# EAGLE board FE3_V3_R11d_corrected (EAGLE 7.7.0), part 1 of 2
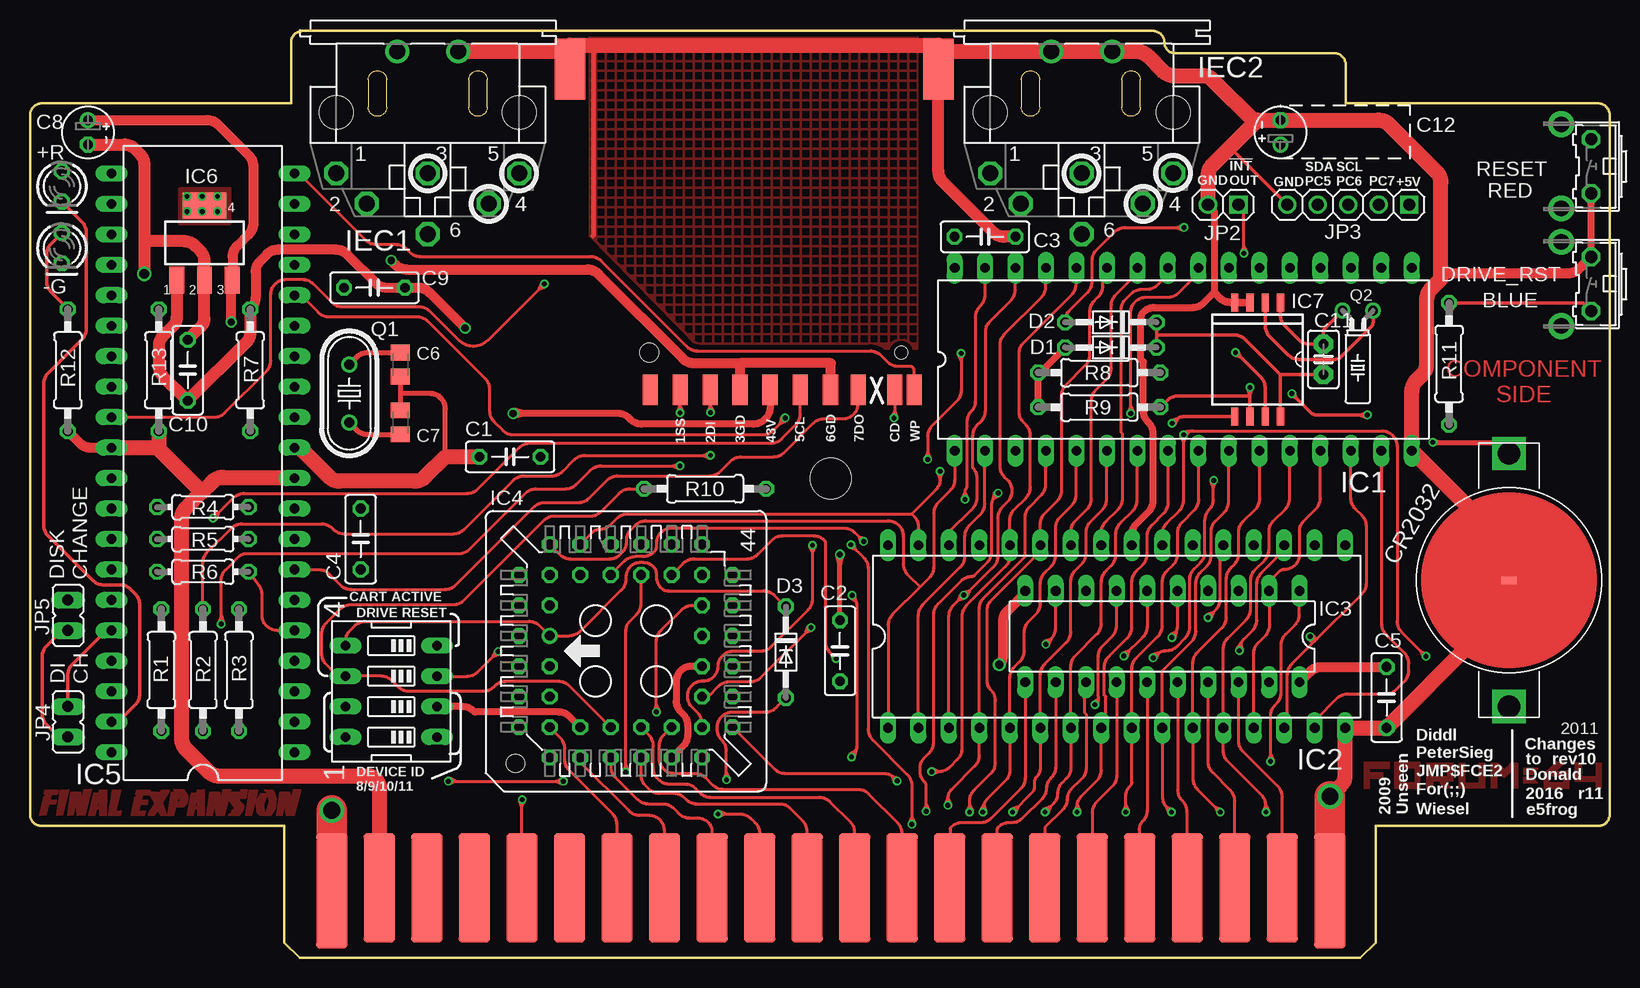
[diagram p1: board, top side]
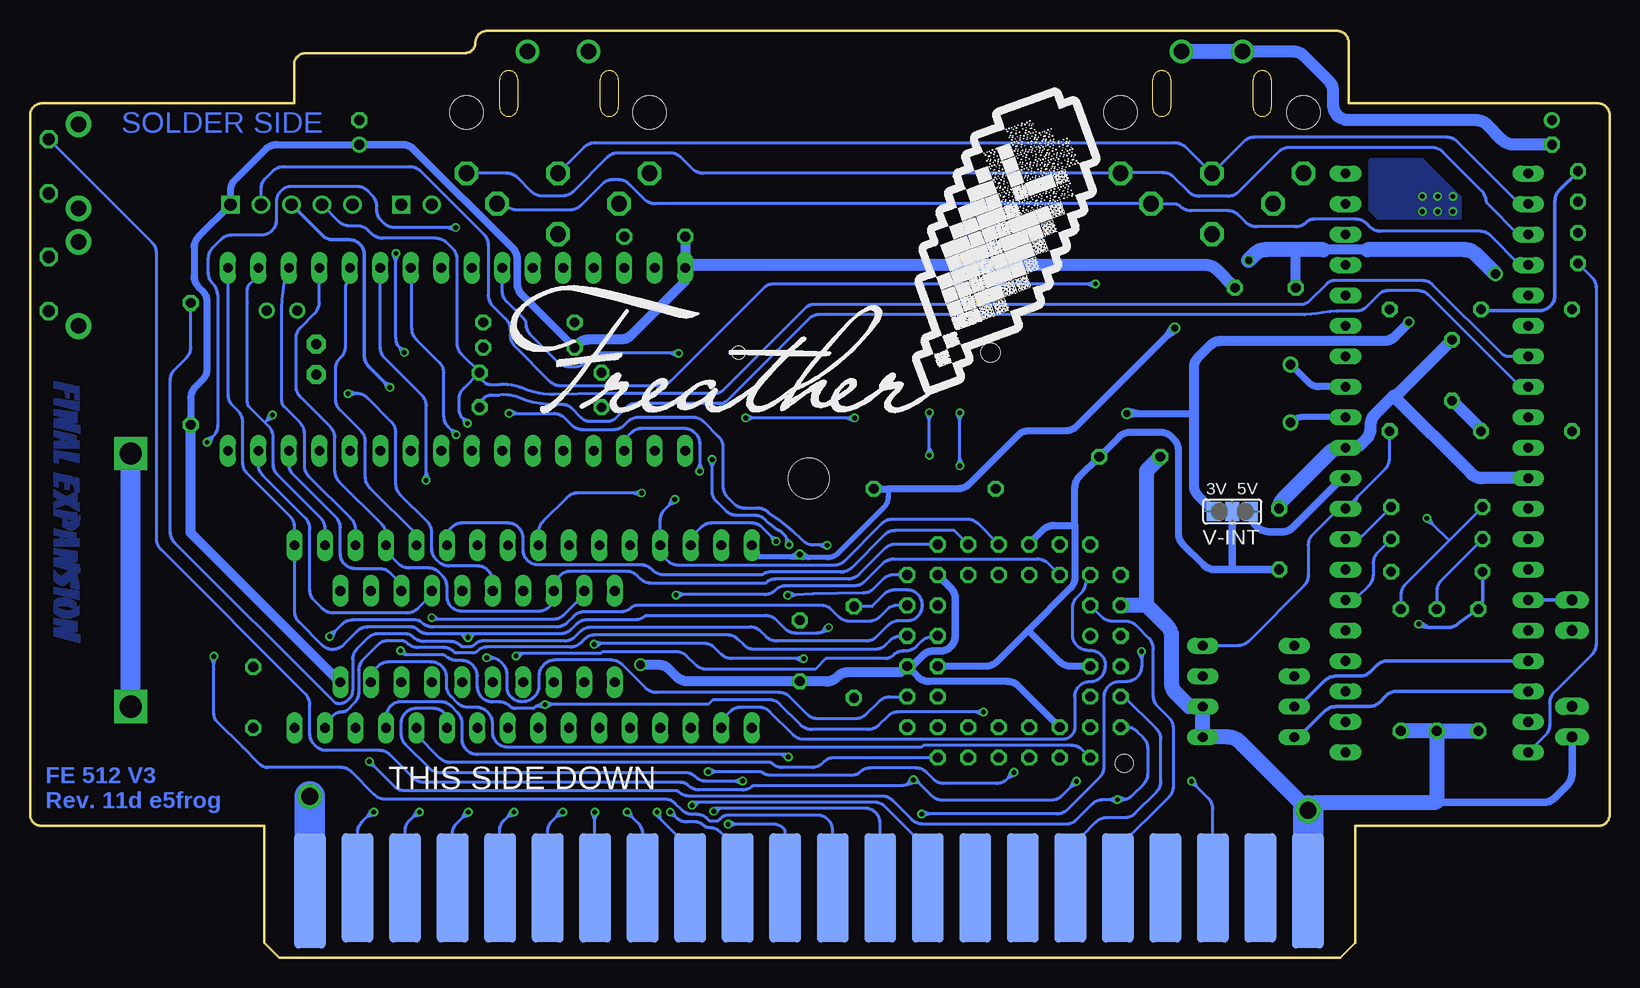
[diagram p2: board, bottom side, seen from below]

Size 131.65 x 77.3 mm. Coordinates in mm from the lower left corner, seen from the top.
Outline: 21.75,71.25 1,71.25 arc90 0,70.25 0,12 arc90 1,11 21.21,11 21.21,1.27 22.48,0 110.87,0 112.14,1.27 112.14,11 130.65,11 arc90 131.65,12 131.65,70.25 arc90 130.65,71.25 109.65,71.25 109.65,74.44 arc90 108.65,75.44 95.4,75.44 arc-90 94.54,76.3 arc90 93.54,77.3 22.75,77.3 arc90 21.75,76.3 21.75,71.25
Outline: 28.19,73.22 arc-180 29.72,73.22 29.72,70.93 arc-180 28.19,70.93 28.19,73.22
Outline: 36.57,73.22 arc-180 38.1,73.22 38.1,70.93 arc-180 36.57,70.93 36.57,73.22
Outline: 82.61,73.22 arc-180 84.14,73.22 84.14,70.93 arc-180 82.61,70.93 82.61,73.22
Outline: 90.99,73.22 arc-180 92.52,73.22 92.52,70.93 arc-180 90.99,70.93 90.99,73.22
Copper layers (1*16): Top 0.035mm / dielectric 1.5mm / Bottom 0.035mm
Design rules "ITEADstudio_DRC": minimum track width 6mil, minimum drill 12mil, track to track 6mil, track to pad 6mil, pad to pad 6mil, via to via 6mil, smd to smd 0mil, copper to edge 10mil, drill to drill 10mil, minimum pad ring 10mil, minimum via ring 6mil, stop-mask expansion 2mil, vias tented up to drill 100mil, thermal gap 10mil
Net classes: 1 DiffPair: width 0.254 mm, drill 0.4 mm, clearance 0.6 mm
Holes 3.4 mm at 66.74,39.97
Holes 1.5 mm at 40.45,16.22
Holes 1.6 mm at 51.6,50.47
Holes 1.1 mm at 72.6,50.47
tRestrict: area 116.9,15.2 to 118.1,15.8; area 126.6,14.7 to 127.7,15.1

## Footprints (pad centres in the part's own frame; a part is rotated, then mirrored left to right if it is on the bottom)
SMD1,27-2,54 = smd 1.27 x 2.54: 1 0,0
LED3MM = drill 0.813 octagon: A -1.27,0; K 1.27,0
C050-025X075 = drill 0.813 octagon: 1 -2.54,0; 2 2.54,0
C0805K = smd 1.3 x 1.6: 1 -1,0; 2 1,0
E2-4 = drill 0.813 pad 1.27: + -1.016,0 | drill 0.813 pad 1.27 octagon: - 1.016,0
C2.5-2 = drill 0.813 pad 1.6 octagon: 1 -1.27,0; 2 1.27,0
CR2032_RETAINER_PK5 = drill 1.85 square: P$1 -10.55,0; P$2 10.55,0 | smd 0.635 x 1.27: P$3 0,0
DO34-7 = drill 0.813 octagon: A 3.81,0; C -3.81,0
EDG-04 = drill 0.813 long: 1 -3.81,-3.81; 2 -1.27,-3.81; 3 1.27,-3.81; 4 3.81,-3.81; 5 3.81,3.81; 6 1.27,3.81; 7 -1.27,3.81; 8 -3.81,3.81
B3F-31XX = drill 1.016 octagon: 1 -2.261,-1.245; 2 2.261,-1.245 | drill 1.295 pad 2.159: 3 -3.505,1.245; 4 3.505,1.245
DIL32 = drill 0.813 long: 1 -17.78,-7.62; 2 -15.24,-7.62; 3 -12.7,-7.62; 4 -10.16,-7.62; 5 -7.62,-7.62; 6 -5.08,-7.62; 7 -2.54,-7.62; 8 0,-7.62; 9 2.54,-7.62; 10 5.08,-7.62; 11 7.62,-7.62; 12 10.16,-7.62; 13 12.7,-7.62; 14 15.24,-7.62; 15 17.78,-7.62; 16 20.32,-7.62; 17 20.32,7.62; 18 17.78,7.62; 19 15.24,7.62; 20 12.7,7.62; 21 10.16,7.62; 22 7.62,7.62; 23 5.08,7.62; 24 2.54,7.62; 25 0,7.62; 26 -2.54,7.62; 27 -5.08,7.62; 28 -7.62,7.62; 29 -10.16,7.62; 30 -12.7,7.62; 31 -15.24,7.62; 32 -17.78,7.62
DIL32' = drill 0.813 long: 1 -19.05,-7.62; 2 -16.51,-7.62; 3 -13.97,-7.62; 4 -11.43,-7.62; 5 -8.89,-7.62; 6 -6.35,-7.62; 7 -3.81,-7.62; 8 -1.27,-7.62; 9 1.27,-7.62; 10 3.81,-7.62; 11 6.35,-7.62; 12 8.89,-7.62; 13 11.43,-7.62; 14 13.97,-7.62; 15 16.51,-7.62; 16 19.05,-7.62; 17 19.05,7.62; 18 16.51,7.62; 19 13.97,7.62; 20 11.43,7.62; 21 8.89,7.62; 22 6.35,7.62; 23 3.81,7.62; 24 1.27,7.62; 25 -1.27,7.62; 26 -3.81,7.62; 27 -6.35,7.62; 28 -8.89,7.62; 29 -11.43,7.62; 30 -13.97,7.62; 31 -16.51,7.62; 32 -19.05,7.62
DIL20 = drill 0.813 long: 1 -11.43,-3.81; 2 -8.89,-3.81; 3 -6.35,-3.81; 4 -3.81,-3.81; 5 -1.27,-3.81; 6 1.27,-3.81; 7 3.81,-3.81; 8 6.35,-3.81; 9 8.89,-3.81; 10 11.43,-3.81; 11 11.43,3.81; 12 8.89,3.81; 13 6.35,3.81; 14 3.81,3.81; 15 1.27,3.81; 16 -1.27,3.81; 17 -3.81,3.81; 18 -6.35,3.81; 19 -8.89,3.81; 20 -11.43,3.81
S44 = drill 0.813: 1 1.27,6.35 | drill 0.813 octagon: 2 -1.27,8.89; 3 -1.27,6.35; 4 -3.81,8.89; 5 -3.81,6.35; 6 -6.35,8.89; 7 -8.89,6.35; 8 -6.35,6.35; 9 -8.89,3.81; 10 -6.35,3.81; 11 -8.89,1.27; 12 -6.35,1.27; 13 -8.89,-1.27; 14 -6.35,-1.27; 15 -8.89,-3.81; 16 -6.35,-3.81; 17 -8.89,-6.35; 18 -6.35,-8.89; 19 -6.35,-6.35; 20 -3.81,-8.89; 21 -3.81,-6.35; 22 -1.27,-8.89; 23 -1.27,-6.35; 24 1.27,-8.89; 25 1.27,-6.35; 26 3.81,-8.89; 27 3.81,-6.35; 28 6.35,-8.89; 29 8.89,-6.35; 30 6.35,-6.35; 31 8.89,-3.81; 32 6.35,-3.81; 33 8.89,-1.27; 34 6.35,-1.27; 35 8.89,1.27; 36 6.35,1.27; 37 8.89,3.81; 38 6.35,3.81; 39 8.89,6.35; 40 6.35,8.89; 41 6.35,6.35; 42 3.81,8.89; 43 3.81,6.35; 44 1.27,8.89
DIL40 = drill 0.813 long: 1 -24.13,-7.62; 2 -21.59,-7.62; 3 -19.05,-7.62; 4 -16.51,-7.62; 5 -13.97,-7.62; 6 -11.43,-7.62; 7 -8.89,-7.62; 8 -6.35,-7.62; 9 -3.81,-7.62; 10 -1.27,-7.62; 11 1.27,-7.62; 12 3.81,-7.62; 13 6.35,-7.62; 14 8.89,-7.62; 15 11.43,-7.62; 16 13.97,-7.62; 17 16.51,-7.62; 18 19.05,-7.62; 19 21.59,-7.62; 20 24.13,-7.62; 21 24.13,7.62; 22 21.59,7.62; 23 19.05,7.62; 24 16.51,7.62; 25 13.97,7.62; 26 11.43,7.62; 27 8.89,7.62; 28 6.35,7.62; 29 3.81,7.62; 30 1.27,7.62; 31 -1.27,7.62; 32 -3.81,7.62; 33 -6.35,7.62; 34 -8.89,7.62; 35 -11.43,7.62; 36 -13.97,7.62; 37 -16.51,7.62; 38 -19.05,7.62; 39 -21.59,7.62; 40 -24.13,7.62
SOT223 = smd 1.219 x 2.235: 1 -2.311,-3.099; 2 0,-3.099; 3 2.311,-3.099 | smd 3.6 x 2.2: 4 0,3.099
SOT176-1 = smd 0.6 x 1.5: 1 -1.905,-4.75; 2 -0.635,-4.75; 3 0.635,-4.75; 4 1.905,-4.75; 5 1.905,4.75; 6 0.635,4.75; 7 -0.635,4.75; 8 -1.905,4.75
MAB6H = drill 1.321 octagon: 1 7.62,5.08; 2 5.08,7.62; 3 0,5.08; 4 -5.08,7.62; 5 -7.62,5.08; 6 0,10.16 | drill 1.321: PE -2.54,-5.08; PE@ 2.54,-5.08 | hole 2.794: 7.62,0; -7.62,0
1X02 = drill 1.016 square: 1 -1.27,0 | drill 1.016: 2 1.27,0
1X05 = drill 1.016 square: 1 -5.08,0 | drill 1.016: 2 -2.54,0; 3 0,0; 4 2.54,0; 5 5.08,0
JP1 = drill 0.914 long: 1 0,-1.27; 2 0,1.27
SMD2,54-5,08 = smd 2.54 x 5.08: 1 0,0
HC49U-V = drill 0.813: 1 -2.413,0; 2 2.413,0
TC26H = drill 0.813: 1 -1.27,0; 2 1.27,0
0207/10 = drill 0.813 octagon: 1 -5.08,0; 2 5.08,0
0204/7 = drill 0.813 octagon: 1 -3.81,0; 2 3.81,0
VIC-20_EXPANSION = smd 2.6 x 9.6: P$1 -41.58,1.98; P$22 41.58,1.98 | smd 2.6 x 9.1: P$2 -37.62,2.23; P$3 -33.66,2.23; P$4 -29.7,2.23; P$5 -25.74,2.23; P$6 -21.78,2.23; P$7 -17.82,2.23; P$8 -13.86,2.23; P$9 -9.9,2.23; P$10 -5.94,2.23; P$11 -1.98,2.23; P$12 1.98,2.23; P$13 5.94,2.23; P$14 9.9,2.23; P$15 13.86,2.23; P$16 17.82,2.23; P$17 21.78,2.23; P$18 25.74,2.23; P$19 29.7,2.23; P$20 33.66,2.23; P$21 37.62,2.23 | smd 2.6 x 9.6 bottom: P$23 -41.58,1.98; P$44 41.58,1.98 | smd 2.6 x 9.1 bottom: P$24 -37.62,2.23; P$25 -33.66,2.23; P$26 -29.7,2.23; P$27 -25.74,2.23; P$28 -21.78,2.23; P$29 -17.82,2.23; P$30 -13.86,2.23; P$31 -9.9,2.23; P$32 -5.94,2.23; P$33 -1.98,2.23; P$34 1.98,2.23; P$35 5.94,2.23; P$36 9.9,2.23; P$37 13.86,2.23; P$38 17.82,2.23; P$39 21.78,2.23; P$40 25.74,2.23; P$41 29.7,2.23; P$42 33.66,2.23; P$43 37.62,2.23
SJ_2 = smd 1.168 x 1.6: 1 -1.524,0; 2 0,0; 3 1.524,0

## Placement (x,y rotation side)
1SS  [SMD1,27-2,54]  54.19,47.38 0 top
2DI  [SMD1,27-2,54]  56.7,47.38 0 top
3GD  [SMD1,27-2,54]  59.17,47.38 0 top
5CL  [SMD1,27-2,54]  64.2,47.38 0 top
6GD  [SMD1,27-2,54]  66.72,47.38 0 top
7DO  [SMD1,27-2,54]  69.01,47.38 0 top
43V  [SMD1,27-2,54]  61.68,47.38 0 top
+R  [LED3MM]  2.65,64.33 270 top
-G  [LED3MM]  2.65,59.18 270 top
C1  100nF  [C050-025X075]  40,41.78 180 top
C2  100nF  [C050-025X075]  67.5,25.61 270 top
C3  100nF  [C050-025X075]  79.59,60.13 0 top
C4  100nF  [C050-025X075]  27.56,34.92 90 top
C5  100nF  [C050-025X075]  113.05,21.72 270 top
C6  33pF  [C0805K]  30.86,49.48 270 top
C7  33pF  [C0805K]  30.86,44.65 90 top
C8  22µF  [E2-4]  4.82,68.83 270 top
C9  100nF  [C050-025X075]  28.7,55.88 180 top
C10  100nF  [C050-025X075]  13.15,49 90 top
C11  22pF  [C2.5-2]  107.79,49.91 90 top
C12  100µF  [E2-4]  104.2,68.83 90 top
CD  [SMD1,27-2,54]  72.06,47.38 0 top
CR2032  CR2032_RETAINER_PK5  [CR2032_RETAINER_PK5]  123.25,31.5 270 top
D1  BAT85  [DO34-7]  90.08,50.9 180 top
D2  BAT85  [DO34-7]  90.08,53 180 top
D3  BAT85  [DO34-7]  62.99,25.5 270 top
DEVICE  [EDG-04]  30.11,22.22 90 top
DRIVE_RST  [B3F-31XX]  128.85,56.2 90 top
IC1  AM29F040B  [DIL32]  94.83,49.91 0 top
IC2  4Mb-55  [DIL32']  90.55,26.8 0 top
IC3  74LS245N  [DIL20]  94.36,26.8 180 top
IC4  CPLD-ATF1504-AS  [S44]  49.66,25.59 90 top
IC5  ATMEGA1284P  [DIL40]  14.41,41.27 90 top
IC6  3V3REG_1703  [SOT223]  14.54,59.63 0 top
IC7  PCF8583T  [SOT176-1]  102.3,49.91 180 top
IEC1  MAB6H  [MAB6H]  33.15,70.5 180 top
IEC2  MAB6H  [MAB6H]  87.65,70.5 180 top
JP2  [1X02]  99.44,62.8 180 top
JP3  [1X05]  109.85,62.8 180 top
JP4  [JP1]  3.15,19.68 0 top
JP5  [JP1]  3.15,28.57 0 top
NC_9  [SMD1,27-2,54]  51.7,47.38 0 top
PAD1  [SMD2,54-5,08]  44.99,74.1 0 top
PAD2  [SMD2,54-5,08]  75.7,74.1 180 top
Q1  8.000MHz  [HC49U-V]  26.61,47.06 270 top
Q2  32768Hz  [TC26H]  110.65,53.98 180 top
R1  3k3  [0207/10]  10.95,24 90 top
R2  3k3  [0207/10]  14.41,24 90 top
R3  3k3  [0207/10]  17.41,24 90 top
R4  1k8  [0204/7]  14.41,37.59 0 top
R5  1k8  [0204/7]  14.41,34.92 0 top
R6  1k8  [0204/7]  14.41,32.2 0 top
R7  10k  [0207/10]  18.35,49 90 top
R8  1k8  [0207/10]  89.1,48.8 180 top
R9  1k8  [0207/10]  89.1,45.92 180 top
R10  10k  [0207/10]  56.26,39.12 180 top
R11  10k  [0207/10]  118.26,49.53 270 top
R12  470  [0207/10]  3.15,49 90 top
R13  470  [0207/10]  10.73,49 90 top
RESET  [B3F-31XX]  128.85,66 90 top
U$2  VIC-20_EXPANSION  [VIC-20_EXPANSION]  66.74,3.62 0 top
V-INT  [SJ_2]  31.46,37.22 0 bottom
WP  [SMD1,27-2,54]  73.68,47.36 0 top

## Tracks (layer width: path | path; a pad name or v marks a point on that pad's centre or on a via)
3V3  (via drill 0.6)
  Top 0.6: 43V.1 61.68,45.88 arc-45 61.3,44.99 61.2,44.88 arc-45 60.31,44.51 50.94,44.51 arc-45 50.05,44.88 49.9,45.03 arc45 49,45.4 v40.26,45.4 | v40.26,45.4 40.29,45.58 41.16,45.4 40.29,45.23 v40.26,45.4
  Top 0.813: C8.+ 14.78,69.85 arc-45 15.67,69.48 18.23,66.92 arc-45 18.6,66.02 18.6,61.23 arc-45 18.23,60.33 17.26,59.36 arc45 16.89,58.47 16.89,56.57 IC6.3 16.76,56.44 v16.76,53.02
  Bottom 0.6: v40.26,45.4 34.73,45.4 34.67,45.47 | v40.26,45.4 40.22,45.23 39.36,45.4 40.22,45.58 v40.26,45.4
  Bottom 0.813: v16.76,53.02 16.76,52.96 17.91,51.81 arc45 18.81,51.44 32.43,51.44 arc-45 33.33,51.06 34.3,50.09 arc-45 34.67,49.19 34.67,45.47 34.67,39.43 arc-45 34.3,38.54 V-INT.1
!C_RESET  (via drill 0.4)
  Top 0.254: v34.86,14.73 v44.45,14.73 | v58.04,14.86 58.04,17.25 arc45 57.67,18.15 57.65,18.17 arc-45 57.28,19.07 57.28,19.24 arc-90 58.55,20.51 61.29,20.51 arc45 62.19,20.88 D3.A | v58.04,14.86 57.82,14.96 58.04,15.46 58.26,14.96 v58.04,14.86 | v34.86,14.73 34.96,14.95 35.46,14.73 34.96,14.51 v34.86,14.73 | v44.45,14.73 44.35,14.51 43.85,14.73 44.35,14.95 v44.45,14.73
  Bottom 0.254: 33.15,5.65 33.08,5.59 U$2.P$25 33.08,12.42 arc-45 33.45,13.32 v34.86,14.73 | v44.45,14.73 45.66,13.52 arc45 46.56,13.14 55.61,13.14 arc45 56.5,13.52 57.85,14.86 v58.04,14.86 | v58.04,14.86 58.17,14.72 arc45 59.07,14.35 71.44,14.35 arc45 72.28,14 75.9,14 arc45 76.79,14.37 arc-45 77.43,14.64 98.82,14.64 arc45 99.72,15.01 101.64,16.93 arc-45 102.54,17.3 106.95,17.3 arc45 107.84,17.68 107.96,17.79 arc45 108.33,18.69 108.33,21.13 arc-45 108.7,22.02 120.72,34.05 arc45 121.09,34.94 121.09,58.73 arc-45 121.47,59.63 RESET.2 | v58.04,14.86 58.07,14.62 57.53,14.54 57.84,14.99 v58.04,14.86 | v58.04,14.86 58.25,14.97 58.51,14.48 57.98,14.62 v58.04,14.86 | v34.86,14.73 34.95,14.51 34.44,14.31 34.63,14.82 v34.86,14.73 | v44.45,14.73 44.68,14.82 44.87,14.31 44.36,14.51 v44.45,14.73
!RESET
  Top 0.254: DEVICE.5 26.3,26.41 arc-45 26.67,27.3 27.06,27.7 arc-45 27.96,28.07 41.57,28.07 arc-45 42.47,27.7 42.93,27.23 arc45 43.83,26.86 | D3.C 62.96,29.3 62.03,30.23 arc45 61.13,30.61 53.2,30.61 arc-45 52.57,30.87 arc-45 52.2,31.77 52.2,32.1 arc45 52,32.59 arc45 51.1,32.96 50.82,32.96 arc45 50.03,32.63 arc45 49.66,31.73 49.66,31.58 arc-45 49.28,30.68 45.84,27.23 arc-45 44.94,26.86 43.83,26.86 | IC4.1 43.83,26.86
  Top 0.305: R11.1 129.42,54.61 DRIVE_RST.1
  Bottom 0.254: D3.C 61.5,29.3 60.5,30.3 arc45 59.61,30.67 58.55,30.67 arc90 57.28,29.4 arc90 58.55,28.13 59.23,28.13 arc-45 60.12,27.76 61.09,26.79 arc45 61.99,26.42 69.42,26.42 arc45 70.32,26.79 70.75,27.22 arc-45 71.65,27.59 84.91,27.59 arc-45 85.81,27.22 86.21,26.82 arc45 87.11,26.45 93.77,26.45 arc-45 94.67,26.08 arc45 95,25.94 95.56,25.94 arc45 95.73,26.01 arc-45 96.63,26.38 98.82,26.38 arc45 99.72,26.76 arc-45 100.35,27.02 102.63,27.02 arc-45 103.53,26.65 104.4,25.77 arc-45 104.77,24.87 104.77,22.29 arc45 105.07,21.58 arc45 105.97,21.21 arc45 106.32,21.35 119.58,34.62 arc45 119.95,35.52 119.95,48.18 arc45 119.58,49.08 118.61,50.05 arc-45 118.24,50.95 118.24,54.59 R11.1
!WE  (via drill 0.4)
  Top 0.254: IC1.31 79.59,55.29 arc-45 79.22,54.39 79.14,54.31 arc45 78.77,53.42 78.77,46.37 arc-45 78.44,45.58 arc45 78.07,44.69 78.07,39.37 arc-45 77.91,38.99 v77.91,38.23 | v77.91,38.23 77.69,38.33 77.91,38.83 78.14,38.33 v77.91,38.23
  Bottom 0.254: v77.91,38.23 78.75,37.39 arc-45 79.12,36.49 IC2.29 79.12,33.72 78.51,33.11 arc-45 77.61,32.73 64.66,32.73 arc-45 63.76,33.11 60.66,36.2 arc45 59.77,36.58 53.55,36.58 arc45 52.65,36.2 IC4.33 | v77.91,38.23 78.14,38.31 78.34,37.8 77.83,38 v77.91,38.23
+5V  (via drill 0.5, 0.6)
  Top 0.406: C2.1 v67.5,33.64 | v67.5,33.64 67.71,33.58 67.5,32.89 67.29,33.58 v67.5,33.64
  Top 0.6: R9.2 R8.2 84.17,48.8 D1.A
  Top 0.813: IC3.20 106.69,23.89 arc-45 107.59,24.26 C5.1 | R7.2 18.42,54.15 arc45 18.79,55.05 18.79,57.2 arc-45 19.17,58.09 19.76,58.68 arc-45 20.65,59.05 25.51,59.05 arc-45 26.41,58.68 28.84,56.25 arc45 29.73,55.88 C9.1 32.37,55.88 arc-45 33.26,55.51 v36.26,52.51 | R12.1 4.15,42.92 arc45 5.05,42.55 IC5.30
  Top 1: 21.97,40.07 IC5.10
  Top 1.016: IC6.1 12.23,53.4 arc-45 11.94,52.7 11.03,51.79 arc45 10.74,51.09 10.74,49.28 arc45 11.03,48.58 C10.1 18.06,51.37 arc45 18.35,52.08 R7.2
  Top 1.27: 14.32,38.83 13.01,37.52 arc45 12.64,36.62 12.64,18.31 arc45 13.01,17.41 14.87,15.55 arc45 15.77,15.18 28.12,15.18 arc-90 29.12,14.18 U$2.P$2 | 14.32,38.83 15.19,39.7 arc-45 16.08,40.07 21.97,40.07 | IC5.30 10.6,42.55 10.73,42.42 | 10.73,42.42 14.32,38.83 | R13.1 10.73,42.42
  Top 1.422: 29.14,5.63 U$2.P$2
  Bottom 0.406: 60.13,39.12 60.13,38.44 arc45 60.5,37.54 64.29,33.75 arc45 65.19,33.38 67.24,33.38 v67.5,33.64 | IC2.32 71.47,34.39 71.47,33.83 71.09,33.45 67.69,33.45 v67.5,33.64 | v67.5,33.64 67.51,33.42 66.8,33.38 67.37,33.81 v67.5,33.64 | v67.5,33.64 67.61,33.82 68.23,33.45 67.51,33.42 v67.5,33.64
  Bottom 0.6: IC5.10 22.54,40.01 | R11.2 118.26,46.7 arc45 117.88,47.6 117.27,48.21 arc-45 116.9,49.1 116.9,54.72 arc-45 117.27,55.62 117.61,55.95 arc45 117.98,56.85 117.98,59.23 arc45 117.61,60.12 JP3.1 114.93,63.99 arc45 114.56,64.89 112,67.45 arc45 111.11,67.82 C12.+ | R10.1 60.13,39.12 54.31,39.12 arc-45 53.41,39.49 49.33,43.57 arc45 48.43,43.94 45.36,43.94 arc-45 44.46,44.31 v36.26,52.51 | v36.26,52.51 36.41,52.61 36.89,51.88 36.16,52.36 v36.26,52.51
  Bottom 0.61: 86.26,50.9 D1.A 90.69,55.32 arc45 91.06,56.22 91.06,58.27 arc-45 91.43,59.17 99.7,67.45 arc-45 100.6,67.82 C12.+ | IC1.32 77.05,57.88 | 22.54,40.01 arc45 22.7,39.61 26.42,35.89 arc45 27.32,35.52 28.29,35.52 arc92 V-INT.3
  Bottom 0.813: IC3.20 118.26,35.45 R11.2 | C3.1 IC1.32 | IC1.32 | IC1.32 77.05,56.43 81.54,51.93 arc45 82.44,51.56 85.08,51.56 arc-45 85.98,51.19 D1.A
  Bottom 1.016: C9.1 32.77,57.41 arc-45 33.67,57.78 77.05,57.78 IC1.32 | R13.1 arc-45 10.82,44.13 C10.1
A0  (via drill 0.4)
  Top 0.254: IC1.12 104.96,42.27 104.96,38.31 arc-45 104.59,37.41 103.62,36.44 arc45 103.25,35.54 103.25,34.05 arc-45 102.88,33.16 102.1,32.38 arc45 101.73,31.48 101.73,29.1 arc-45 101.35,28.2 99.81,26.66 arc45 99.44,25.76 IC2.12 99.44,17.29 arc45 99.81,16.39 102.62,13.58 arc-45 103,12.68 v103,12.16 | v103,12.16 102.77,12.26 102.99,12.76 103.22,12.26 v103,12.16
  Bottom 0.254: U$2.P$43 104.36,10.43 arc45 103.99,11.33 103.16,12.16 v103,12.16 | IC2.12 99.44,18.61 97.49,16.66 arc-45 96.6,16.29 69.94,16.29 arc45 69.84,16.25 arc-45 68.94,15.87 66.5,15.87 arc-45 65.6,16.25 65.52,16.33 arc45 64.62,16.7 IC4.17 | v103,12.16 103.2,12.29 103.49,11.82 102.95,11.92 v103,12.16
A1  (via drill 0.4)
  Top 0.254: IC1.11 102.49,42.27 102.49,38.31 arc-45 102.12,37.41 101.08,36.38 arc45 100.71,35.48 100.71,33.67 arc-45 100.34,32.77 100.07,32.5 arc45 99.69,31.61 99.69,28.4 arc-45 99.32,27.5 97.27,25.45 arc45 96.9,24.56 IC2.11 96.9,14.97 arc45 97.27,14.07 v99.19,12.16 | v72.26,14.76 72.03,14.99 arc45 71.13,15.37 62.95,15.37 arc-45 62.05,15.74 IC4.18 | v99.19,12.16 98.96,12.07 98.76,12.59 99.27,12.39 v99.19,12.16 | v72.26,14.76 72.04,14.66 71.82,15.17 72.34,14.99 v72.26,14.76
  Bottom 0.254: U$2.P$42 100.39,5.6 100.39,10.59 arc45 100.02,11.48 99.34,12.16 v99.19,12.16 | v72.26,14.76 75.32,14.76 arc45 76.22,15.14 arc-45 77.01,15.46 97.48,15.46 arc45 98.38,15.83 100.37,17.82 arc45 100.74,18.72 100.74,19.53 arc90 99.47,20.8 98.03,20.8 arc45 97.13,20.42 96.9,20.19 IC2.11 | v99.19,12.16 99.39,12.29 99.68,11.82 99.14,11.92 v99.19,12.16 | v72.26,14.76 72.36,14.99 72.86,14.76 72.36,14.54 v72.26,14.76
A2  (via drill 0.4)
  Top 0.254: IC1.10 99.88,42.27 99.88,38.05 arc-45 99.51,37.16 98.8,36.44 arc45 98.42,35.54 98.42,33.55 arc-45 98.05,32.65 97.53,32.12 arc45 97.15,31.22 97.15,27.26 arc-45 96.78,26.36 94.36,23.94 IC2.10 94.36,13.45 arc45 94.73,12.55 v95.12,12.16 | v95.12,12.16 94.9,12.07 94.7,12.59 95.21,12.39 v95.12,12.16
  Bottom 0.254: U$2.P$41 96.46,5.62 96.46,10.33 arc45 96.08,11.23 95.15,12.16 v95.12,12.16 | v95.12,12.16 95.34,12.26 95.56,11.75 95.04,11.93 v95.12,12.16
A3  (via drill 0.4)
  Top 0.254: IC1.9 97.41,42.27 97.41,38.24 arc-45 97.04,37.35 96,36.31 arc45 95.63,35.41 95.63,33.67 arc-45 95.26,32.77 94.73,32.25 arc45 94.36,31.35 94.36,27.7 arc-45 93.99,26.81 92.19,25.01 arc45 91.82,24.11 IC2.9 91.82,14.67 arc-45 91.68,14.34 arc45 91.31,13.44 v91.31,12.16 | v91.31,12.16 91.09,12.26 91.31,12.76 91.53,12.26 v91.31,12.16
  Bottom 0.254: U$2.P$40 92.52,5.64 92.52,10.59 arc45 92.15,11.48 91.47,12.16 v91.31,12.16 | v91.31,12.16 91.52,12.29 91.81,11.82 91.27,11.92 v91.31,12.16
A4  (via drill 0.4)
  Top 0.254: IC1.8 94.87,42.27 94.87,37.99 arc-45 94.5,37.09 93.46,36.06 arc45 93.09,35.16 93.09,33.67 arc-45 92.72,32.77 92.19,32.25 arc45 91.82,31.35 91.82,27.58 arc-45 91.45,26.68 89.91,25.14 arc45 89.53,24.24 89.53,21.91 89.66,21.78 89.66,20.45 89.28,20.07 IC2.8 89.28,15.67 arc-45 88.91,14.77 87.62,13.48 arc45 87.25,12.59 v87.25,12.16 | v87.25,12.16 87.03,12.26 87.26,12.76 87.47,12.25 v87.25,12.16
  Bottom 0.254: U$2.P$39 88.52,5.6 88.52,10.52 arc45 88.15,11.42 87.41,12.16 v87.25,12.16 | v87.25,12.16 87.45,12.29 87.74,11.82 87.2,11.92 v87.25,12.16
A5  (via drill 0.4)
  Top 0.254: IC1.7 92.27,42.27 92.27,38.18 arc-45 91.89,37.28 90.86,36.25 arc45 90.49,35.35 90.49,33.61 arc-45 90.12,32.71 89.65,32.25 arc45 89.28,31.35 89.28,27.89 arc-45 88.91,27 87.11,25.2 arc45 86.74,24.3 IC2.7 86.74,15.86 arc-45 86.37,14.96 85.98,14.57 arc45 85.63,13.73 arc-45 85.26,12.84 v84.58,12.16 | v84.58,12.16 84.49,12.39 85.01,12.59 84.81,12.07 v84.58,12.16
  Bottom 0.254: U$2.P$38 84.58,5.62 v84.58,12.16 | v84.58,12.16 84.8,12.06 84.58,11.56 84.36,12.06 v84.58,12.16
A6  (via drill 0.4)
  Top 0.254: IC1.6 89.73,42.27 89.73,38.24 arc-45 89.35,37.35 88.38,36.38 arc45 88.01,35.48 88.01,33.74 arc-45 87.64,32.84 87.11,32.31 arc45 86.74,31.41 86.74,27.2 arc-45 86.37,26.3 84.57,24.5 arc45 84.2,23.6 IC2.6 84.2,15.88 arc-45 83.88,15.11 arc45 83.69,14.65 83.69,14.54 83.69,14.23 arc-45 83.51,13.79 v81.88,12.16 | v81.88,12.16 81.8,12.39 82.31,12.59 82.11,12.07 v81.88,12.16
  Bottom 0.254: U$2.P$37 80.58,5.62 80.58,10.33 arc-45 80.95,11.23 v81.88,12.16 | v81.88,12.16 81.97,11.93 81.46,11.74 81.66,12.25 v81.88,12.16
A7  (via drill 0.4)
  Top 0.254: 87.18,42.27 IC1.5 87.18,42.26 87.18,38.63 arc-45 86.81,37.73 85.84,36.76 arc45 85.47,35.86 85.47,33.55 arc-45 85.1,32.65 84.57,32.12 arc45 84.2,31.22 84.2,29.55 arc-45 83.83,28.65 83.24,28.06 arc45 82.87,27.16 82.87,25.61 arc-45 82.5,24.71 82.03,24.25 arc45 81.66,23.35 IC2.5 81.66,15.67 arc-45 81.29,14.77 79.78,13.26 arc45 79.41,12.36 v79.41,12.16 | v79.41,12.16 79.2,12.28 79.47,12.76 79.64,12.23 v79.41,12.16
  Bottom 0.254: 76.64,5.61 U$2.P$36 76.87,5.83 76.87,9.37 79.15,11.65 arc37 v79.41,12.16 | v79.41,12.16 79.56,11.97 79.13,11.63 79.16,12.18 v79.41,12.16
A8  (via drill 0.4)
  Top 0.254: v78.29,12.16 78.29,13.06 arc-45 78.67,13.96 80.08,15.38 arc45 80.45,16.27 80.45,21.45 arc45 80.08,22.34 arc-45 79.76,23.13 79.76,28.94 arc-45 80.13,29.84 84.07,33.78 84.07,34.29 IC2.27 84.2,36.18 arc-45 84.57,37.08 85.61,38.11 arc45 85.98,39.01 85.98,46.91 arc-45 86.35,47.81 87.96,49.41 arc45 88.33,50.31 88.33,53.89 arc-45 88.7,54.79 89.04,55.13 arc45 89.41,56.02 89.41,56.77 89.75,57.12 IC1.27 | v78.29,12.16 78.07,12.26 78.29,12.76 78.52,12.26 v78.29,12.16
  Bottom 0.254: U$2.P$35 72.68,9.05 74.11,10.48 arc-45 75.01,10.85 arc45 75.57,11.09 arc-45 76.17,11.34 76.91,11.34 arc45 77.81,11.71 78.26,12.16 v78.29,12.16 | v78.29,12.16 78.37,11.93 77.86,11.75 78.07,12.26 v78.29,12.16
A9  (via drill 0.4)
  Top 0.254: IC2.26 86.74,35.54 arc-45 87.11,36.44 88.08,37.41 arc45 88.46,38.31 88.46,46.46 arc-45 88.83,47.36 89.73,48.27 arc45 90.11,49.17 90.11,54.4 arc-45 90.48,55.3 92.27,57.09 92.27,57.52 IC1.26 | v77.6,50.42 77.6,47.33 arc-45 77.22,46.43 75.17,44.38 arc45 74.8,43.48 v74.8,41.56 | v68.4,34.45 69.48,33.38 arc-45 69.85,32.48 69.85,19.07 arc45 70.22,18.17 73.12,15.27 arc-45 73.49,14.37 v73.49,11.15 | v73.49,11.15 73.27,11.25 73.49,11.75 73.71,11.25 v73.49,11.15 | v68.4,34.45 68.63,34.54 68.83,34.03 68.32,34.23 v68.4,34.45 | v77.6,50.42 77.82,50.32 77.6,49.82 77.37,50.32 v77.6,50.42 | v74.8,41.56 74.58,41.66 74.8,42.16 75.02,41.66 v74.8,41.56
  Bottom 0.254: U$2.P$34 68.72,10.54 arc-45 68.82,10.78 arc-45 69.72,11.15 v73.49,11.15 | v77.6,50.42 84.06,50.42 arc-45 84.95,50.05 85.35,49.65 arc45 86.25,49.28 86.72,49.28 arc45 87.62,49.65 89.92,51.95 arc45 90.3,52.85 arc-45 90.46,53.25 91.92,54.71 arc45 92.29,55.61 IC1.26 | v68.4,34.45 68.4,34.48 | v74.8,41.56 74.8,38.94 arc-45 74.43,38.05 73.65,37.27 arc-45 72.75,36.89 71.26,36.89 arc45 70.37,36.52 arc-15 69.28,35.69 arc50 v68.4,34.45 | v73.49,11.15 73.39,10.93 72.89,11.15 73.39,11.37 v73.49,11.15 | v68.4,34.45 68.23,34.62 68.61,35.02 68.65,34.47 v68.4,34.45 | v77.6,50.42 77.69,50.64 78.2,50.42 77.69,50.2 v77.6,50.42 | v74.8,41.56 75.02,41.46 74.8,40.96 74.58,41.46 v74.8,41.56
A10  (via drill 0.4)
  Top 0.254: IC2.23 94.36,35.35 arc-45 94.73,36.25 95.77,37.28 arc45 96.14,38.18 v96.14,43.62 | v96.14,43.62 arc-45 96.91,43.94 112.65,43.94 arc-90 113.92,42.67 113.92,28.09 arc45 114.29,27.19 v116.33,25.15 | v96.14,43.62 96.12,43.61 | v116.33,25.15 116.1,25.06 115.91,25.57 116.42,25.37 v116.33,25.15 | v96.14,43.62 96.36,43.53 96.14,43.02 95.92,43.53 v96.14,43.62 | v96.14,43.62 96.12,43.87 96.66,43.91 96.33,43.48 v96.14,43.62
  Bottom 0.254: U$2.P$33 64.76,10.64 arc-90 66.03,11.91 73.55,11.91 arc-45 74.19,11.53 arc45 74.49,11.4 74.93,11.4 arc45 75.19,11.6 arc-45 76.09,11.97 76.44,11.97 arc45 77.33,12.34 77.86,12.87 arc-45 78.76,13.24 102.06,13.24 arc45 102.96,13.61 104.85,15.5 arc-45 105.75,15.88 111.82,15.88 arc45 112.53,16.17 113.94,17.58 116.04,19.68 arc45 116.33,20.39 116.33,24.09 v116.33,25.15 | v96.14,43.62 96.78,44.27 arc45 97.15,45.17 97.15,48.75 arc-45 97.53,49.65 99.45,51.57 arc45 99.82,52.47 99.82,57.44 IC1.23 | v116.33,25.15 116.55,25.05 116.33,24.55 116.11,25.05 v116.33,25.15 | v96.14,43.62 96.05,43.85 96.56,44.05 96.37,43.54 v96.14,43.62
A11  (via drill 0.4)
  Top 0.254: IC2.25 89.28,35.48 arc-45 89.65,36.38 90.69,37.41 arc45 91.06,38.31 91.06,43.69 90.93,43.81 90.93,54.02 arc-45 91.3,54.92 91.77,55.38 arc-45 92.66,55.75 93.07,55.75 arc45 93.97,56.12 94.71,56.86 IC1.25 | v80.68,38.77 80.51,38.6 arc45 80.14,37.7 80.14,33.86 arc-45 79.76,32.97 78.69,31.89 arc-45 78.5,31.81 arc45 77.61,31.44 75.68,29.52 arc45 75.31,28.62 75.31,17.99 arc-45 74.94,17.09 74.54,16.69 arc45 74.17,15.79 74.17,15.58 arc45 74.54,14.68 arc-45 74.68,14.35 v74.68,12.22 | v74.68,12.22 74.45,12.32 74.68,12.82 74.9,12.32 v74.68,12.22 | v80.68,38.77 80.78,38.55 80.29,38.31 80.44,38.83 v80.68,38.77
  Bottom 0.254: U$2.P$32 60.8,11.21 arc-90 62.07,12.48 74.42,12.48 v74.68,12.22 | v80.68,38.77 85.99,38.77 arc-45 86.89,38.4 88.91,36.38 arc-45 89.28,35.48 IC2.25 | v74.68,12.22 74.49,12.06 74.13,12.48 74.68,12.47 v74.68,12.22 | v80.68,38.77 80.77,38.99 81.28,38.77 80.77,38.55 v80.68,38.77
A12  (via drill 0.4)
  Top 0.254: IC1.4 84.65,42.27 84.65,39.48 arc-45 84.27,38.59 83.3,37.62 arc45 82.93,36.72 82.93,33.47 79.49,30.03 arc45 79.12,29.13 IC2.4 79.12,16.91 arc-45 78.75,16.01 76.86,14.12 arc45 76.48,13.22 v76.48,12.73 | v76.48,12.73 76.26,12.83 76.49,13.33 76.71,12.83 v76.48,12.73
  Bottom 0.254: U$2.P$31 56.84,9.05 60.4,12.61 arc-45 61.3,12.99 76.23,12.99 v76.48,12.73 | v76.48,12.73 76.3,12.57 75.94,12.99 76.49,12.97 v76.48,12.73
A13  (via drill 0.4)
  Top 0.254: IC1.28 87.18,57.52 87.18,56.22 arc-45 86.81,55.32 82.79,51.3 arc45 82.42,50.4 82.42,45.55 arc45 82.79,44.65 83,44.44 arc-45 83.38,43.54 83.38,39.26 arc-45 83,38.36 82.03,37.39 arc45 81.66,36.49 IC2.28 81.65,34 81.65,33.53 arc-45 81.28,32.63 78.02,29.37 arc45 77.65,28.47 77.65,17.45 arc-45 77.28,16.55 76.63,15.9 arc-45 75.73,15.53 v75.13,15.53 | v49.65,15.48 49.65,27.22 arc-45 50.02,28.11 50.55,28.65 arc45 50.93,29.55 IC4.34 | v49.65,15.48 49.43,15.58 49.65,16.08 49.87,15.58 v49.65,15.48 | v75.13,15.53 75.23,15.75 75.73,15.53 75.23,15.3 v75.13,15.53
  Bottom 0.254: v49.65,15.48 50.22,14.91 arc45 51.12,14.54 55.48,14.54 arc45 56.38,14.91 56.94,15.47 arc-45 57.83,15.84 61.61,15.84 arc-45 62.51,15.47 arc45 63.06,15.24 70.02,15.24 arc45 70.71,15.53 v75.13,15.53 | 49.63,15.5 v49.65,15.48 | v49.65,15.48 49.88,15.57 50.07,15.06 49.56,15.26 v49.65,15.48 | v75.13,15.53 75.04,15.3 74.53,15.53 75.04,15.75 v75.13,15.53
A14  (via drill 0.4)
  Top 0.254: IC2.3 76.58,28.49 arc-45 76.95,29.39 v77.82,30.26 | IC1.29 84.65,57.52 84.65,55.96 arc-45 84.27,55.06 81.21,52 arc45 80.83,51.1 80.83,41.01 arc45 81.21,40.11 81.48,39.84 arc-90 81.48,38.04 81.02,37.58 arc45 80.64,36.69 80.64,33.48 arc-45 80.27,32.59 77.95,30.26 v77.82,30.26 | v77.82,30.26 77.91,30.03 77.39,29.83 77.59,30.34 v77.82,30.26 | v77.82,30.26 77.77,30.5 78.3,30.61 78.03,30.14 v77.82,30.26
  Bottom 0.254: IC4.38 46.81,32.9 arc-45 47.71,33.27 59.67,33.27 arc-45 60.57,32.9 62.08,31.39 arc45 62.98,31.02 68.66,31.02 arc-45 69.55,30.65 arc45 70.42,30.29 77.79,30.29 v77.82,30.26 | v77.82,30.26 77.71,30.04 77.22,30.29 77.73,30.48 v77.82,30.26
A15  (via drill 0.4)
  Top 0.254: IC4.37 46.86,35.49 arc-45 47.48,35.75 arc45 48.38,36.12 48.9,36.65 arc-45 49.8,37.02 73.47,37.02 | 73.47,37.02 73.67,36.82 arc-45 74.04,35.92 IC2.31 | v75.85,40.58 75.85,39.93 arc-45 75.48,39.03 73.47,37.02 | v75.85,40.58 76.07,40.48 75.85,39.98 75.63,40.48 v75.85,40.58
  Bottom 0.254: IC1.3 82.14,43.21 81.56,43.79 arc45 80.66,44.16 77.14,44.16 arc45 76.24,43.79 76.22,43.77 arc45 75.85,42.88 v75.85,40.58 | v75.85,40.58 75.63,40.67 75.85,41.18 76.07,40.67 v75.85,40.58
A16
  Top 0.254: IC2.2 74.04,28.56 arc-45 74.41,29.45 77.54,32.59 arc45 77.91,33.48 77.91,35.16 arc-45 78.29,36.06 79.19,36.97 arc45 79.57,37.86 79.57,42.27 IC1.2
  Bottom 0.254: IC4.41 43.31,31.62 43.69,31.24 arc45 44,30.48 44.39,30.09 arc-45 44.77,29.19 44.77,26.92 arc-90 43.5,25.65 43.31,25.65 arc90 42.04,24.38 42.04,24.32 arc90 43.31,23.05 43.32,23.05 arc-90 44.59,21.78 44.59,19.49 arc90 45.48,18.22 67.16,18.22 arc45 68.06,18.6 69.98,20.52 arc-45 70.88,20.89 72.43,20.89 arc-45 73.33,20.52 74.04,19.81 IC2.2
A17  (via drill 0.4)
  Top 0.254: IC2.30 76.58,35.5 78.56,37.47 arc45 78.93,38.37 78.93,40.02 arc45 78.58,40.86 78.58,43.54 arc-45 78.95,44.44 79.26,44.74 arc45 79.63,45.64 79.63,52.18 arc-45 80,53.08 81.73,54.81 arc45 82.1,55.71 82.1,57.52 IC1.30 | IC4.36 49.54,33.09 arc-45 50.44,33.47 51.1,33.47 arc45 52,33.84 arc45 52.2,34.32 52.2,34.59 arc-45 52.57,35.49 arc-45 53.4,35.83 67.84,35.83 arc-45 68.74,35.46 v69.47,34.73 | v69.47,34.73 69.24,34.65 69.04,35.16 69.56,34.96 v69.47,34.73
  Bottom 0.254: v69.47,34.73 70.62,35.89 arc-45 71.52,36.26 74.85,36.26 arc-45 75.75,35.89 76.58,35.05 IC2.30 | v69.47,34.73 69.38,34.96 69.89,35.16 69.7,34.65 v69.47,34.73
A18
  Top 0.254: IC1.1 77.09,42.27 77.09,39.9 arc-45 76.72,39 75.68,37.96 arc45 75.31,37.07 75.31,32.59 arc-45 74.94,31.7 74.17,30.92 | IC4.39 44.14,33.65 arc45 45.04,33.27 48.3,33.27 arc45 49.2,33.65 49.35,33.79 arc45 49.72,34.69 49.72,34.84 arc-45 50.09,35.74 50.43,36.08 arc-45 51.32,36.45 71.5,36.45 arc-90 72.77,35.18 72.77,32.85 arc45 73.14,31.95 74.17,30.92 | 74.17,30.92 71.87,28.63 arc45 71.5,27.73 IC2.1
BLK1
  Top 0.254: U$2.P$13 72.68,10.36 arc45 72.31,11.26 69.9,13.66 arc45 69.01,14.03 57.8,14.03 arc-45 56.9,14.4 56.31,14.99 arc45 55.42,15.37 53.72,15.37 arc-90 52.45,16.64 52.45,17.7 arc-45 52.82,18.6 IC4.16
BLK2
  Top 0.254: IC4.14 51.57,18.6 arc-45 51.94,17.7 51.94,15.83 arc45 52.31,14.93 52.4,14.85 arc45 53.29,14.48 54.59,14.48 arc-45 55.49,14.11 55.82,13.77 arc45 56.72,13.4 65.77,13.4 arc-45 66.67,13.03 68.33,11.36 arc-45 68.71,10.46 68.71,5.61 U$2.P$12
BLK3
  Top 0.254: U$2.P$11 64.76,10.53 arc45 64.39,11.43 63.36,12.46 arc45 62.46,12.83 55.58,12.83 arc-45 54.68,13.2 54.54,13.34 arc45 53.64,13.72 52.47,13.72 arc-45 51.57,14.09 51.3,14.36 arc-45 50.93,15.26 IC4.13
BLK5
  Top 0.254: R10.2 49.99,39.12 arc45 49.09,38.74 47.55,37.2 arc-45 46.65,36.83 43.7,36.83 arc45 42.81,36.46 36.18,29.84 arc-45 35.29,29.46 26.75,29.46 arc45 25.85,29.09 24.69,27.93 arc45 24.32,27.03 24.32,25.36 arc45 24.69,24.46 25.28,23.87 arc45 26.18,23.5 DEVICE.6 29.25,23.5 arc-45 30.15,23.12 30.68,22.6 arc45 31.58,22.23 37.76,22.23 arc45 38.66,22.6 38.74,22.68 arc-45 39.64,23.05 44.05,23.05 arc-45 44.95,22.68 IC4.12
C_BLK5  (via drill 0.4)
  Top 0.254: U$2.P$10 60.8,10.37 arc45 60.43,11.27 60.06,11.63 arc45 59.16,12 v57.34,12 | DEVICE.3 36.43,23.49 arc45 37.33,23.87 v39.02,25.56 | v57.34,12 57.44,12.22 57.94,12 57.44,11.78 v57.34,12 | v39.02,25.56 39.11,25.33 38.59,25.13 38.79,25.65 v39.02,25.56
  Bottom 0.254: v39.02,25.56 39.02,24.32 arc90 40.29,23.05 40.86,23.05 arc-90 42.13,21.78 42.13,15.96 arc45 42.5,15.06 45.19,12.37 arc45 46.09,12 v57.34,12 | v57.34,12 57.24,11.78 56.74,12 57.24,12.22 v57.34,12 | v39.02,25.56 39.24,25.46 39.02,24.96 38.8,25.46 v39.02,25.56
C_R/W  (via drill 0.4)
  Top 0.254: v103.38,16.38 103.38,20.18 arc-45 103.75,21.07 103.89,21.22 arc45 104.27,22.12 104.27,26.08 arc-45 104.64,26.98 105.42,27.76 arc45 105.79,28.66 IC3.1 | U$2.P$5 41,13.19 v41.02,13.21 | v103.38,16.38 103.16,16.48 103.38,16.98 103.6,16.48 v103.38,16.38 | v41.02,13.21 41.24,13.1 41,12.61 40.79,13.12 v41.02,13.21
  Bottom 0.254: v41.02,13.21 42.24,13.21 arc-45 43.14,12.84 44.43,11.55 arc45 45.32,11.18 57.29,11.18 arc45 58.19,11.55 59.76,13.12 arc-45 60.66,13.49 76.72,13.49 arc45 77.62,13.87 arc-45 77.79,13.94 100.41,13.94 arc45 101.3,14.31 v103.38,16.38 | v41.02,13.21 40.66,13.21 arc-45 39.76,13.58 38.85,14.49 arc-45 38.48,15.38 38.48,17.44 arc-45 38.85,18.34 39.38,18.87 arc-45 40.28,19.24 IC4.6 | v103.38,16.38 103.47,16.16 102.95,15.96 103.15,16.47 v103.38,16.38 | v41.02,13.21 41.12,13.43 41.62,13.21 41.12,12.99 v41.02,13.21 | v41.02,13.21 40.91,12.99 40.42,13.23 40.93,13.43 v41.02,13.21
CD0
  Top 0.254: U$2.P$21 104.36,13.42 arc45 103.99,14.31 101.08,17.22 arc-45 100.71,18.12 IC3.18
CD1
  Top 0.254: U$2.P$20 100.4,13.09 arc45 100.03,13.99 98.54,15.47 arc-45 98.17,16.37 IC3.17
CD2
  Top 0.254: U$2.P$19 96.44,9.8 96.39,9.84 96.39,12.21 arc45 96.02,13.1 96,13.12 arc-45 95.63,14.02 IC3.16
CD3
  Top 0.254: IC3.15 93.09,12.3 arc-45 92.72,11.41 arc45 92.42,10.7 92.42,5.65 U$2.P$18
CD4
  Top 0.254: IC3.14 90.55,15.2 arc-45 90.18,14.3 88.89,13.01 arc45 88.52,12.11 88.52,5.6 U$2.P$17
CD5
  Top 0.254: 84.58,5.62 U$2.P$16 84.71,5.75 84.71,7.21 84.58,7.33 84.58,10.89 86.05,12.36 arc45 86.42,13.26 arc-45 86.75,14.04 87.64,14.93 arc45 88.01,15.83 88.01,20.32 87.88,20.45 87.88,22.86 IC3.13
CD6
  Top 0.254: IC3.12 85.47,15.93 arc-45 85.1,15.03 85.03,14.96 arc45 84.71,14.18 arc-45 84.34,13.28 82.7,11.64 arc-45 81.8,11.27 81.58,11.27 arc45 80.69,10.9 arc45 80.58,10.65 80.58,5.62 U$2.P$15
CD7
  Top 0.254: IC3.11 82.93,15 arc-45 82.56,14.11 80.09,11.64 arc-45 79.2,11.27 77.65,11.27 arc45 76.75,10.9 arc45 76.68,10.72 76.68,5.64 U$2.P$14
COOL  (via drill 0.4)
  other vias: 13.08,62.23 14.35,62.23 15.62,62.23 13.08,63.5 14.35,63.5 15.62,63.5
  pour Bottom (no thermals): 19.94,66.55 19.87,66.61 15.62,66.61 12.45,63.44 12.45,61.66 19.3,61.66 20,62.36 20,66.36 20,66.48 arc90
  pour Top (no thermals): 12.42,61.23 16.67,61.23 16.7,64.14 12.45,64.14
D0  (via drill 0.4)
  Top 0.254: IC2.13 101.98,25.38 arc-45 102.35,26.28 102.94,26.87 arc45 103.31,27.77 103.31,30.54 IC3.2 103.31,30.67 103.31,31.43 104.09,32.2 arc-45 104.52,32.38 arc90 105.79,33.66 105.79,35.54 arc-45 106.16,36.44 107.16,37.44 arc45 107.53,38.34 IC1.13 | v68.52,30.23 68.53,30.22 arc-45 68.9,29.32 68.9,17.73 arc-45 68.53,16.84 v68.45,16.76 | v68.52,30.23 68.76,30.26 68.83,29.72 68.38,30.02 v68.52,30.23 | v68.45,16.76 68.33,16.97 68.8,17.25 68.69,16.71 v68.45,16.76
  Bottom 0.254: IC2.13 101.98,20.1 arc90 100.71,21.37 97.46,21.37 arc45 96.56,21 96,20.44 arc45 95.63,19.54 95.63,18.22 arc-90 94.36,16.95 68.64,16.95 v68.45,16.76 | IC4.28 59.67,31.94 arc-45 60.57,31.57 61.35,30.79 arc45 62.25,30.42 arc-3 v68.52,30.23 | v68.45,16.76 68.42,16.73 | v68.52,30.23 68.4,30.01 67.92,30.26 68.43,30.45 v68.52,30.23 | v68.45,16.76 68.48,17.01 69.02,16.95 68.62,16.59 v68.45,16.76
D1  (via drill 0.4)
  Top 0.254: 107.06,26.41 105.15,24.5 arc45 104.78,23.6 104.78,19.56 IC2.14 | v106.68,26.8 107.06,26.41 | 107.06,26.41 111.01,30.36 arc45 111.38,31.25 111.38,35.99 arc45 111.01,36.88 110.45,37.45 arc-45 110.07,38.34 IC1.14 | v106.68,26.8 106.92,26.78 106.88,26.23 106.5,26.63 v106.68,26.8 | v106.68,26.8 106.85,26.97 107.24,26.59 106.7,26.55 v106.68,26.8
  Bottom 0.254: IC1.14 110.07,41.2 arc-45 109.7,40.3 106.16,36.76 arc45 105.79,35.86 105.79,33.72 arc-90 104.52,32.45 102.51,32.45 arc45 101.61,32.08 100.71,31.18 IC3.3 | v106.68,26.8 105.69,27.79 arc45 104.79,28.16 99.47,28.16 arc45 98.99,27.96 arc-45 98.09,27.59 87.77,27.59 arc-45 86.88,27.96 86.35,28.49 arc45 85.45,28.86 82.41,28.86 arc-45 81.51,29.23 arc45 81.11,29.4 65.74,29.4 arc45 64.84,29.03 64.25,28.44 arc-45 63.35,28.07 61.74,28.07 arc-45 60.84,28.44 60.25,29.03 arc45 59.35,29.4 IC4.26 | v106.68,26.8 106.45,26.71 106.26,27.22 106.77,27.02 v106.68,26.8
D2
  Top 0.254: IC1.15 112.65,42 112.65,27.84 arc45 113.02,26.95 114.53,25.43 arc-45 114.9,24.54 114.9,23.95 arc-45 114.53,23.06 113.86,22.39 arc-45 112.97,22.02 109.81,22.02 arc45 108.91,21.64 107.09,19.82 IC2.15
  Bottom 0.254: IC1.15 112.61,41.13 arc-45 112.24,40.23 108.7,36.69 arc45 108.33,35.8 108.33,30.69 arc-45 107.96,29.79 107.31,29.14 arc-45 106.41,28.77 100.22,28.77 arc-45 99.32,29.14 98.17,30.29 IC3.4 | IC4.24 59.07,26.86 arc-45 59.97,26.49 60.33,26.12 arc45 61.23,25.75 71.29,25.75 arc45 72.19,26.12 72.65,26.58 arc-45 73.55,26.96 84.56,26.96 arc-45 85.46,26.58 85.73,26.31 arc45 86.63,25.94 93.49,25.94 arc-45 94.39,25.57 arc45 94.71,25.43 96.13,25.43 arc45 96.31,25.5 arc-45 97.2,25.88 99.33,25.88 arc45 100.23,26.25 arc-45 100.71,26.45 101.8,26.45 arc-45 102.7,26.08 103.89,24.88 arc-45 104.27,23.98 104.27,22.15 arc45 104.64,21.25 105.23,20.66 arc45 105.58,20.51 arc-45 106.48,20.14 107.06,19.56 IC2.15
D3  (via drill 0.4)
  Top 0.254: v95.15,26.71 95.26,26.82 arc45 95.63,27.72 IC3.5 | IC4.21 56.51,21.78 57.41,22.68 arc-45 58.31,23.05 60.05,23.05 arc45 60.95,23.42 v65.09,27.56 | v95.15,26.71 95.03,26.93 95.51,27.19 95.39,26.66 v95.15,26.71 | v65.09,27.56 65.17,27.33 64.66,27.14 64.86,27.65 v65.09,27.56
  Bottom 0.254: IC1.17 115.12,57.5 115.12,46.95 arc-45 114.75,46.05 114.29,45.58 arc45 113.92,44.69 113.92,41.29 arc-45 113.55,40.4 109.97,36.82 arc45 109.6,35.92 IC2.17 109.6,28.91 arc-45 109.23,28.01 107.28,26.06 arc-45 106.44,25.72 arc-45 105.55,26.09 104.42,27.22 arc45 103.52,27.59 99.85,27.59 arc45 99.37,27.39 arc-45 98.47,27.02 95.15,27.02 | v65.09,27.56 65.11,27.56 | 95.15,27.02 87.46,27.02 arc-45 86.56,27.39 86.1,27.85 arc45 85.2,28.22 81.18,28.22 arc-45 80.33,28.57 70.38,28.57 arc45 69.48,28.2 68.76,27.49 arc-45 67.86,27.11 66.06,27.11 arc-45 65.16,27.49 v65.09,27.56 | v95.15,26.71 95.15,27.02 | v95.15,26.71 94.95,26.57 94.63,27.02 95.18,26.96 v95.15,26.71 | v95.15,26.71 95.12,26.96 95.67,27.02 95.35,26.57 v95.15,26.71 | v65.09,27.56 65.3,27.68 65.57,27.21 65.04,27.32 v65.09,27.56
D4  (via drill 0.4)
  Top 0.254: IC3.6 93.09,27.64 arc-45 92.72,26.74 v91.15,25.18 | v91.15,25.18 91.07,25.4 91.58,25.6 91.38,25.09 v91.15,25.18 | 110.77,45.26 111.47,45.02 v111.44,45.28 111.44,45.5 110.77,45.26 | 105.6,46.58 105.25,47.28 v105.16,47.05 105.01,46.89 105.6,46.58
  Top 0.305: v105.16,47.05 106.75,45.46 arc45 107.2,45.28 v111.44,45.28
  Bottom 0.254: IC2.18 107.06,35.8 arc-45 107.43,36.69 111.01,40.27 arc45 111.38,41.17 111.38,43.42 arc-45 111.75,44.31 112.08,44.64 | 112.08,44.64 112.21,44.78 113.34,45.91 arc45 113.53,46.36 113.53,54.63 113.53,55.74 arc45 113.34,56.19 112.69,56.84 arc-45 112.61,57.03 IC1.18 | IC3.6 93.09,31.4 arc-90 94.36,32.67 96.72,32.67 arc45 97.62,33.04 97.8,33.22 arc45 98.17,34.12 98.17,35.48 arc-45 98.54,36.38 100.78,38.62 arc45 101.15,39.52 101.15,43.8 arc-45 101.53,44.7 103.51,46.68 arc-45 104.41,47.05 v105.16,47.05 | IC4.25 56.07,26.8 56.43,26.8 arc-45 57.33,26.43 57.79,25.96 arc45 58.69,25.59 58.84,25.59 arc-45 59.74,25.22 arc45 60.38,24.96 65.34,24.96 66.23,24.07 75.29,24.07 arc45 76.19,24.44 76.91,25.16 arc-45 77.81,25.53 83.95,25.53 84.07,25.4 90.93,25.4 v91.15,25.18 | v111.44,45.28 112.08,44.64 | v91.15,25.18 90.98,25.01 90.6,25.4 91.14,25.42 v91.15,25.18 | v111.44,45.28 111.67,45.36 111.87,44.85 111.35,45.05 v111.44,45.28 | v105.16,47.05 105.06,46.83 104.56,47.05 105.06,47.28 v105.16,47.05
D5  (via drill 0.4)
  Top 0.254: IC3.7 90.55,27.7 arc-45 90.18,26.81 89.4,26.03 arc45 89.03,25.13 89.03,21.8 arc-45 v88.74,21.11 | v100.77,25.62 100.77,25.67 arc-45 101.15,26.57 101.86,27.28 arc45 102.23,28.18 102.23,31.19 arc-45 102.61,32.09 104.23,33.71 arc45 IC2.19 | v52.2,20.51 52.2,26.4 arc-45 52.57,27.3 54.3,29.03 arc-45 55.2,29.4 IC4.27 | v88.74,21.11 88.59,21.3 89.01,21.65 88.98,21.1 v88.74,21.11 | v52.2,20.51 51.97,20.61 52.2,21.11 52.42,20.61 v52.2,20.51 | v100.77,25.62 100.58,25.76 100.9,26.21 101.01,25.67 v100.77,25.62
  Bottom 0.254: IC2.19 104.52,35.73 arc-45 104.89,36.63 108.4,40.14 arc45 108.77,41.04 108.77,43.73 arc-45 109.15,44.63 110.47,45.95 arc45 110.66,46.4 110.66,54.2 arc20 IC1.19 | v88.74,21.11 88.93,21.11 arc-45 89.69,20.8 91.23,20.8 arc45 91.64,20.96 arc-45 92.54,21.34 93.09,21.34 arc90 94.36,22.61 94.36,23.48 arc-45 94.73,24.38 94.78,24.43 arc-45 95.68,24.8 96.09,24.8 arc45 96.99,25.17 arc-45 97.24,25.27 100.42,25.27 v100.77,25.62 | v52.2,20.51 59.29,20.51 arc-45 60.19,20.14 60.91,19.42 arc45 61.8,19.05 66.53,19.05 arc45 67.43,19.42 69.16,21.16 arc-45 70.06,21.53 74.74,21.53 75.12,21.14 88.71,21.14 v88.74,21.11 | v88.74,21.11 88.87,21.32 89.34,21.03 88.81,20.88 v88.74,21.11 | v88.74,21.11 88.63,20.9 88.14,21.14 88.65,21.34 v88.74,21.11 | v52.2,20.51 52.29,20.73 52.8,20.51 52.29,20.29 v52.2,20.51 | v100.77,25.62 100.82,25.38 100.29,25.27 100.56,25.75 v100.77,25.62
D6
  Bottom 0.254: IC4.29 59.54,34.48 arc-45 60.44,34.11 62.59,31.96 arc45 63.48,31.59 69.51,31.59 arc-45 70.36,31.24 79.9,31.24 arc45 80.79,31.61 81.03,31.85 arc-45 81.93,32.23 86.63,32.23 arc-45 87.53,31.85 87.64,31.74 arc-45 88.01,30.84 IC3.8 88.01,30.16 arc90 89.28,28.89 95.63,28.89 arc90 96.9,30.16 96.9,30.97 arc-45 97.27,31.87 97.53,32.13 arc-45 98.43,32.5 100.05,32.5 arc45 100.94,32.87 101.82,33.75 101.82,34.26 IC2.20 101.98,35.29 arc-45 102.35,36.19 105.86,39.7 arc45 106.23,40.59 106.23,43.35 arc-45 106.61,44.25 109.1,46.74 arc45 109.47,47.64 109.47,51.67 arc45 109.1,52.57 107.91,53.77 arc-45 107.53,54.66 IC1.20
D7  (via drill 0.4)
  Top 0.254: IC4.32 54.43,32.9 arc-45 55.33,33.27 59.73,33.27 arc45 60.63,33.65 61.79,34.81 arc-45 62.69,35.18 65.32,35.18 arc-45 66.22,34.81 arc-45 66.29,34.63 66.29,33.27 66.29,26.37 arc45 66.67,25.47 v67.18,24.96 | IC2.21 arc45 99.19,33.8 99.19,29.93 arc-45 98.81,29.03 v98.17,28.38 | v84.65,26.15 85.1,26.6 arc45 85.47,27.5 IC3.9 | v67.18,24.96 66.96,24.87 66.76,25.38 67.27,25.18 v67.18,24.96 | v84.65,26.15 84.56,26.38 85.07,26.57 84.87,26.06 v84.65,26.15 | v98.17,28.38 98.08,28.61 98.59,28.81 98.4,28.3 v98.17,28.38
  Bottom 0.254: v67.18,24.96 73.17,24.96 arc45 74.06,25.33 74.59,25.85 arc-45 75.49,26.23 84.57,26.23 v84.65,26.15 | v98.17,28.38 98.01,28.23 88.06,28.23 arc-45 87.16,28.6 85.53,30.23 IC3.9 | IC2.21 99.44,35.31 103.32,39.19 arc45 103.69,40.09 103.69,43.03 arc-45 104.07,43.93 105.8,45.67 arc45 106.17,46.56 106.17,49.13 arc45 105.8,50.03 105.72,50.11 arc-45 105.34,51.01 105.34,55.8 arc45 104.97,56.7 104.96,56.71 104.96,57.5 IC1.21 | v67.18,24.96 67.28,25.18 67.78,24.96 67.28,24.73 v67.18,24.96 | v84.65,26.15 84.52,25.94 84.05,26.23 84.58,26.38 v84.65,26.15 | v98.17,28.38 98.13,28.14 97.59,28.23 98.02,28.57 v98.17,28.38
EE/CE  (via drill 0.4)
  Top 0.254: v93.6,25.02 93.86,25.28 arc-45 94.69,25.62 arc45 95.59,25.99 96.27,26.68 arc45 96.65,27.58 96.65,31.54 arc-45 97.02,32.44 97.54,32.97 arc45 97.92,33.86 97.92,36.49 arc-45 98.29,37.39 arc45 98.62,38.18 98.62,39.78 v98.65,39.81 | v93.6,25.02 93.52,25.25 94.04,25.43 93.82,24.92 v93.6,25.02 | v98.65,39.81 98.86,39.7 98.62,39.22 98.42,39.73 v98.65,39.81
  Bottom 0.254: IC4.20 59.99,21.78 arc-45 60.89,21.41 61.98,20.31 arc45 62.88,19.94 65.99,19.94 arc45 66.89,20.31 68.33,21.76 arc-45 69.23,22.13 79.45,22.13 arc45 80.35,22.5 82.3,24.46 arc-45 83.2,24.83 87.93,24.83 arc-45 88.83,24.46 88.88,24.41 arc-45 89.25,23.51 89.25,22.69 arc45 89.62,21.79 89.67,21.74 arc45 90.57,21.37 90.66,21.37 arc45 91.56,21.74 arc45 91.88,22.53 91.88,23.64 arc-45 92.26,24.53 92.37,24.65 arc-45 93.27,25.02 v93.6,25.02 | v98.65,39.81 98.62,39.85 98.62,46.02 arc-45 98.99,46.92 102.08,50.01 arc45 102.45,50.91 IC1.22 | v93.6,25.02 93.51,24.79 93,24.99 93.49,25.24 v93.6,25.02 | v98.65,39.81 98.42,39.9 98.62,40.41 98.86,39.92 v98.65,39.81
EE/OE  (via drill 0.4)
  Top 0.254: IC4.19 56.01,19.54 arc45 55.63,20.44 55.17,20.9 arc-45 54.8,21.8 54.8,21.84 arc-90 56.07,23.11 56.13,23.11 arc90 57.34,24.32 arc-90 58.61,25.59 60.88,25.59 arc45 61.77,25.96 64.84,29.03 arc45 65.21,29.93 v65.21,34.42 | v91.73,45.4 91.73,53.82 arc-90 93,55.09 94.82,55.09 arc45 95.72,55.46 97.09,56.83 97.09,57.21 97.28,57.4 IC1.24 | v91.73,45.4 91.5,45.5 91.73,46 91.95,45.5 v91.73,45.4 | v65.21,34.42 65.44,34.32 65.21,33.82 64.99,34.32 v65.21,34.42
  Bottom 0.254: v91.73,45.4 88,45.4 arc45 87.1,45.03 86.51,44.44 arc-45 85.61,44.07 83.01,44.07 arc-45 82.11,44.44 81.84,44.71 arc45 80.94,45.09 76.41,45.09 arc45 75.51,44.71 74.29,43.49 arc45 73.91,42.59 73.91,39.33 arc-45 73.54,38.43 73.02,37.9 arc-45 72.12,37.53 71.01,37.53 arc45 70.11,37.16 arc11 67.24,34.79 arc-45 66.34,34.42 v65.21,34.42 | v91.73,45.4 91.63,45.18 91.12,45.4 91.63,45.62 v91.73,45.4 | v65.21,34.42 65.31,34.64 65.81,34.42 65.31,34.2 v65.21,34.42
G
  Bottom 0.254: IC4.7 43.95,17.34 arc-45 44.85,17.72 57.21,17.72 57.37,17.56 91.82,17.56 arc90 93.09,18.83 93.09,19.54 arc-45 93.46,20.44 93.54,20.52 arc-45 94.44,20.89 95.14,20.89 arc45 96.03,21.26 96.56,21.79 arc45 96.93,22.69 96.93,23.4 arc-90 98.2,24.67 101.77,24.67 arc-45 102.67,24.3 103.25,23.72 IC3.19
GND  (via drill 0.6, 0.7, 0.8, 1.4)
  Top 0.254: 75.7,75.58 75.7,76.1 | PAD1.1 44.99,75.58 44.99,76.1 | PAD2.1 75.7,75.58 | 75.7,75.58 76.87,75.58 | 6GD.1 66.74,47.38
  Top 0.305: JP3.5 100.09,67.49 100.09,67.68 | JP4.1 2.94,18.41 arc-45 2.04,18.79 1.39,19.44 arc-45 1.01,20.34 1.01,25.13 arc-45 1.39,26.03 2.32,26.96 arc-45 JP5.1
  Top 0.406: C6.2 30.86,47.06 | 34.61,41.78 34.61,45.79 arc90 33.34,47.06 30.86,47.06 | 30.86,47.06 C7.2 | 46.93,76.45 46.93,76.14 | 46.93,76.14 46.93,60.2 | 44.99,76.1 46.89,76.1 46.93,76.14
  Top 0.6: JP2.2 98.68,62.29 98.68,55.5 97.78,54.6 arc-45 96.88,54.23 93.68,54.23 arc45 92.78,53.86 arc45 92.58,53.38 92.58,49.91 92.77,49.72 92.77,45.61 arc45 93.14,44.71 93.23,44.63 arc-45 93.6,43.73 93.6,38.12 arc-45 93.23,37.22 92.19,36.19 arc45 91.82,35.29 IC2.24 | IC4.10 44.95,20.14 arc45 44.05,20.51 37.12,20.51 arc-45 36.95,20.58 arc45 36.05,20.95 DEVICE.2 | DRIVE_RST.2 RESET.1
  Top 0.61: IC7.3 IC7.4 100.04,54.66 arc-45 99.14,55.03 98.68,55.5
  Top 0.813: v80.77,24.45 arc45 81.09,25.21 81.09,28.05 arc-45 81.46,28.95 82.93,30.42 IC3.10 | 3GD.1 59.17,49.59 | 66.74,47.38 66.74,49.59 59.17,49.59 | 59.17,49.59 55.33,49.59 arc-45 54.43,49.97 47.36,57.03 arc45 46.46,57.4 31.39,57.4 arc-45 30.49,57.78 v30.1,58.17 | 117.57,56.61 117.57,57.09 128.19,57.09 arc45 129.09,57.46 DRIVE_RST.2
  Top 1.016: 9.52,59.75 12.87,59.75 arc-45 13.77,59.38 14.17,58.98 arc-45 14.54,58.08 IC6.2 14.54,53.34 arc-45 14.25,52.64 C10.2 | 75.63,75.6 75.7,76.1 | C8.- 7.86,67.82 arc-45 8.75,67.45 9.15,67.05 arc-45 9.52,66.15 9.52,59.75 | 9.52,59.75 v9.52,57.02 | C3.2 81.17,60.13 arc-45 80.27,60.51 76.06,64.72 arc-45 75.69,65.61 PAD2.1
  Top 1.27: v108.33,13.46 109.23,14.36 arc45 109.6,15.26 IC2.16 C5.2 120.27,26.42 CR2032.P$3 123.54,33.9 IC1.16 115.15,47.26 arc-45 115.53,48.15 116.02,48.65 arc45 116.4,49.55 116.4,54.91 arc-45 116.77,55.81 117.57,56.61 117.57,64.66 arc45 117.2,65.56 113.27,69.48 arc45 112.38,69.85 C12.- 102.26,69.85 102.09,69.68 | JP2.2 98.17,65.24 arc-45 98.54,66.14 100.09,67.68 102.09,69.68 | 102.09,69.68 98.58,73.19 arc45 97.68,73.57 95.3,73.57 arc-45 94.41,73.94 93.14,75.21 arc45 92.24,75.58 IEC2.PE IEC2.PE@ | 85.06,75.53 IEC2.PE@ | 76.87,75.58 IEC2.PE@ | 44.99,76.1 75.7,76.1 | IEC1.PE 44.99,75.58 | C1.2 34.61,41.78 32.95,40.12 arc-45 32.05,39.75 25.8,39.75 arc-45 24.9,40.12 22.48,42.55 IC5.11
  Top 2.54: U$2.P$44 108.33,5.61 v108.33,13.46 | v25.14,12.32 25.14,5.61 U$2.P$1
  Bottom 0.254: U$2.P$44 108.33,5.61 | 25.14,5.61 U$2.P$1
  Bottom 0.6: IC4.10 49.28,22.68 arc-45 50.18,23.05 56.75,23.05 arc45 57.65,23.42 IC4.22
  Bottom 0.61: JP4.1 3.15,15.35 arc45 3.52,14.45 4.64,13.33 arc45 5.54,12.95 14.6,12.95 | IC4.30 54.92,30.85 arc45 54.55,29.95 54.55,26.86 arc90 55.82,25.59 56.37,25.59 arc-45 57.27,25.22 58.16,24.32 IC4.22
  Bottom 0.813: IC4.22 58.55,24.13 58.8,24.13 59.12,23.81 63.48,23.81 arc-45 64.38,23.44 64.4,23.42 arc45 65.3,23.05 67.48,23.05 C2.2 76.86,23.07 arc45 77.76,23.44 78.39,24.08 arc-45 79.29,24.45 v80.77,24.45 80.71,24.38 | 20.19,59.05 23.88,59.05 | C9.2 26.16,59.05
  Bottom 1.016: C8.- 8.04,67.82 arc45 8.94,68.19 10.23,69.48 arc-45 11.13,69.85 21.78,69.85 arc90 23.05,71.12 23.05,72.25 arc-45 23.42,73.14 25.47,75.19 arc-45 26.37,75.56 30.59,75.56 IEC1.PE@ | IC5.31 10.65,40.01 arc45 11.55,40.38 18.03,46.86 | IC5.11 21.54,42.55 arc-45 20.65,42.92 20.31,43.25 arc-45 19.94,44.15 19.94,44.43 arc45 19.57,45.33 18.03,46.86 | C10.2 17.68,47.01 arc45 18.03,46.86
  Bottom 1.27: R2.1 R3.1 | 23.88,59.05 26.16,59.05 28.68,59.05 arc-45 29.58,58.68 v30.1,58.17 | R2.1 14.41,13.02 14.6,12.95 24.51,12.95 v25.14,12.32 30.87,18.04 arc-45 31.77,18.41 DEVICE.1 DEVICE.2 35.05,20.95 36.14,22.04 arc45 36.51,22.94 36.51,26.78 arc-45 36.88,27.68 38.61,29.4 | R2.1 R1.1 | 38.61,29.4 IC4.42 | 38.61,29.4 38.61,40.64 C1.2 | v9.52,57.02 11.18,58.68 arc-45 12.08,59.05 20.19,59.05 | IEC1.PE IEC1.PE@ | C4.2 arc45 27.24,38.22 23.29,42.17 arc45 22.4,42.55 IC5.11
  Bottom 2.54: v108.33,13.46 108.32,13.45 U$2.P$44 | 25.14,5.61 v25.14,12.32
  pour Top (isolate 0.406, no thermals, hatched): 46.65,76.8 46.65,60.2 55.82,50.8 73.95,50.8 73.95,76.8
  pour Top: 46.8,60.13 47.12,60.13 47.12,59.82
  pour Top: 47.62,59.31 47.94,59.31 47.94,58.99
  pour Top: 48.39,58.48 48.7,58.48 48.7,58.17
  pour Top: 49.21,57.66 49.53,57.66 49.53,57.34
  pour Top: 50.04,56.83 50.35,56.83 50.35,56.52
  pour Top: 50.8,56.01 51.12,56.01 51.12,55.69
  pour Top: 51.62,55.18 51.94,55.18 51.94,54.86
  pour Top: 52.45,54.36 52.77,54.36 52.77,54.04
  pour Top: 53.28,53.53 53.59,53.53 53.59,53.21
  pour Top: 54.04,52.7 54.35,52.7 54.35,52.39
  pour Top: 54.86,51.88 55.18,51.88 55.18,51.56
  pour Top: 73.53,51.18 73.85,51.18 73.85,50.86
  pour Top: 71.06,51.18 71.37,51.18 71.37,50.86
I2C_N  (via drill 0.4)
  Top 0.305: IC7.5 96.3,45.16 arc45 95.4,44.79 v95.19,44.58 | v95.19,44.58 95.11,44.78 95.63,44.98 95.38,44.48 v95.19,44.58
  Bottom 0.254: R8.1 94.21,48.77 | JP3.4 105.91,61.4 arc-45 105.01,61.02 104.35,61.02 arc45 103.45,60.65 103.18,60.38 arc-45 102.28,60.01 97.81,60.01 arc45 96.91,59.64 96.45,59.17 arc45 96.07,58.27 96.07,51.26 arc-45 95.7,50.37 94.18,48.84 R8.1 | v95.19,44.58 95.51,44.9 arc45 95.88,45.8 95.88,46.59 arc45 95.51,47.49 94.2,48.8 | v95.19,44.58 95.09,44.8 95.6,45.01 95.41,44.49 v95.19,44.58 | R8.1 arc-90 93.19,47.8 92.49,47.8 arc27 90.53,47.48 arc-24 87.93,46.98 84.08,47.06 74.57,47.06 arc-45 73.87,47.35 67.03,54.19 arc45 66.32,54.48 25.73,54.48 arc-45 25.03,54.77 23.6,56.19 arc45 22.9,56.49 15.53,56.49 arc45 14.82,56.19 9.08,50.46 arc-45 8.38,50.16 IC5.27
  Bottom 0.305: 94.2,48.8 R8.1
I2C_P  (via drill 0.4)
  Top 0.305: v101.66,47.56 101.66,46.86 | 101.66,46.86 IC7.6 | R9.1 94.76,46.49 arc-45 95.65,46.86 101.66,46.86 | v101.66,47.56 101.87,47.48 101.66,46.96 101.46,47.48 v101.66,47.56
  Bottom 0.254: R9.1 arc90 93.15,46.95 92.49,46.95 arc28 90.86,46.69 arc-24 87.92,46.13 87.21,46.13 arc45 86.51,45.83 85.69,45.02 arc-45 84.99,44.73 83.53,44.73 arc-45 82.83,45.02 81.94,45.91 arc45 81.23,46.2 74.22,46.2 arc-45 73.51,46.5 66.68,53.33 arc45 65.97,53.62 25.38,53.62 arc-4 23.89,53.81 arc9 22.16,53.95 21.02,53.95 arc-45 20.32,54.24 19.22,55.34 arc45 18.51,55.63 15.88,55.63 arc45 15.17,55.34 7.75,47.92 arc-45 7.04,47.62 IC5.28
  Bottom 0.305: v101.66,47.56 103.42,49.32 arc45 103.79,50.22 103.79,58.61 arc-90 105.06,59.88 106.41,59.88 arc45 107.31,60.25 JP3.3 | v101.66,47.56 101.58,47.76 102.09,47.99 101.86,47.47 v101.66,47.56
IEC_ATN
  Bottom 0.254: IEC2.3 85.47,67.61 arc45 84.57,67.98 36.25,67.98 arc45 35.36,67.61 33.17,65.42 IEC1.3 30.52,68.05 arc45 29.62,68.43 13.6,68.43 arc45 12.7,68.05 7.51,62.87 IC5.22 | IC5.22
IEC_CLK